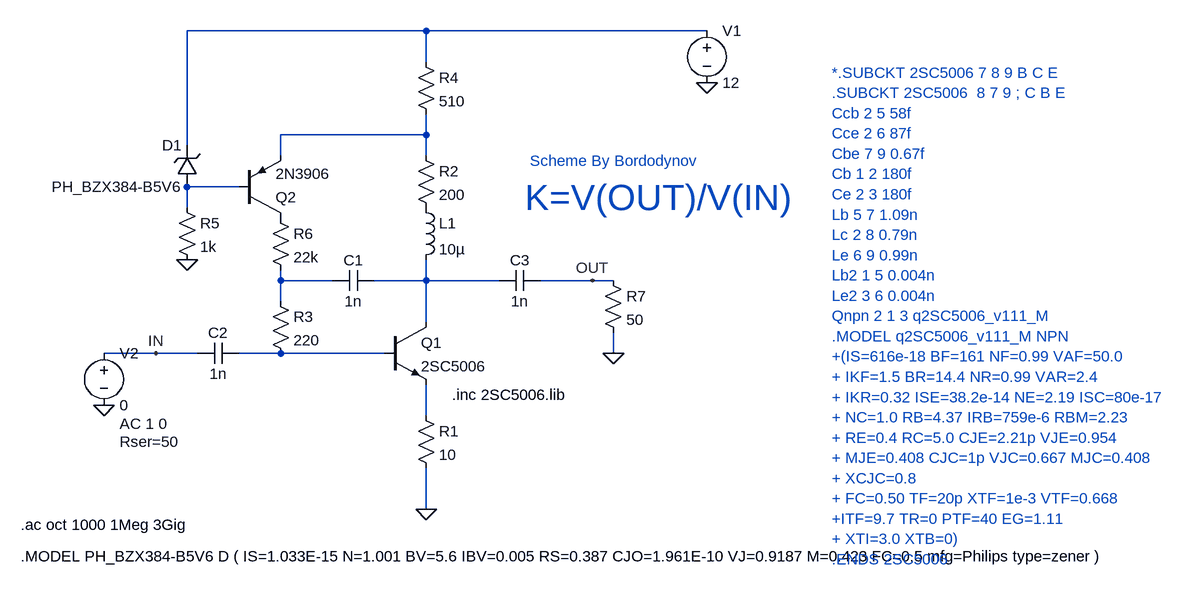
[diagram p0: schematic AMP.asc]
AMP.asc, the LTspice schematic file:
Version 4
SHEET 1 2192 680
WIRE 688 -176 320 -176
WIRE 1120 -176 688 -176
WIRE 688 -128 688 -176
WIRE 688 -16 688 -48
WIRE 688 -16 464 -16
WIRE 320 0 320 -176
WIRE 464 16 464 -16
WIRE 688 16 688 -16
WIRE 400 64 320 64
WIRE 320 96 320 64
WIRE 464 208 464 192
WIRE 544 208 464 208
WIRE 688 208 688 176
WIRE 688 208 608 208
WIRE 800 208 688 208
WIRE 944 208 864 208
WIRE 976 208 944 208
WIRE 464 240 464 208
WIRE 688 272 688 208
WIRE 272 320 192 320
WIRE 336 320 272 320
WIRE 464 320 400 320
WIRE 624 320 464 320
WIRE 976 320 976 288
WIRE 688 416 688 368
WIRE 688 560 688 496
FLAG 1120 -96 0
FLAG 688 560 0
FLAG 192 400 0
FLAG 976 320 0
FLAG 320 176 0
FLAG 944 208 OUT
FLAG 272 320 IN
SYMBOL npn 624 272 R0
SYMATTR InstName Q1
SYMATTR Value 2SC5006
SYMATTR Prefix XQN
SYMBOL res 672 400 R0
SYMATTR InstName R1
SYMATTR Value 10
SYMBOL cap 608 192 R90
WINDOW 0 0 32 VBottom 2
WINDOW 3 32 32 VTop 2
SYMATTR InstName C1
SYMATTR Value 1n
SYMBOL res 672 0 R0
SYMATTR InstName R2
SYMATTR Value 200
SYMBOL res 448 224 R0
SYMATTR InstName R3
SYMATTR Value 220
SYMBOL pnp 400 112 M180
SYMATTR InstName Q2
SYMATTR Value 2N3906
SYMBOL zener 336 64 R180
WINDOW 0 24 64 Left 2
WINDOW 3 24 0 Left 2
SYMATTR InstName D1
SYMATTR Value PH_BZX384-B5V6
SYMATTR Description Diode
SYMATTR Type diode
SYMBOL res 672 -144 R0
SYMATTR InstName R4
SYMATTR Value 510
SYMBOL res 304 80 R0
SYMATTR InstName R5
SYMATTR Value 1k
SYMBOL voltage 1120 -192 R0
WINDOW 123 0 0 Left 2
WINDOW 39 0 0 Left 2
SYMATTR InstName V1
SYMATTR Value 12
SYMBOL ind 672 80 R0
SYMATTR InstName L1
SYMATTR Value 10µ
SYMBOL res 448 96 R0
SYMATTR InstName R6
SYMATTR Value 22k
SYMBOL voltage 192 304 R0
WINDOW 123 24 124 Left 2
WINDOW 39 24 152 Left 2
SYMATTR Value2 AC 1 0
SYMATTR SpiceLine Rser=50
SYMATTR InstName V2
SYMATTR Value 0
SYMBOL cap 400 304 R90
WINDOW 0 0 32 VBottom 2
WINDOW 3 32 32 VTop 2
SYMATTR InstName C2
SYMATTR Value 1n
SYMBOL cap 864 192 R90
WINDOW 0 0 32 VBottom 2
WINDOW 3 32 32 VTop 2
SYMATTR InstName C3
SYMATTR Value 1n
SYMBOL res 960 192 R0
SYMATTR InstName R7
SYMATTR Value 50
TEXT 728 384 Left 2 !.inc 2SC5006.lib
TEXT 64 584 Left 2 !.ac oct 1000 1Meg 3Gig
TEXT 840 80 Left 5 ;K=V(OUT)/V(IN)
TEXT 64 632 Left 2 !.MODEL PH_BZX384-B5V6 D ( IS=1.033E-15 N=1.001 BV=5.6 IBV=0.005 RS=0.387 CJO=1.961E-10 VJ=0.9187 M=0.423 FC=0.5 mfg=Philips type=zener )
TEXT 1312 -112 Left 2 ;*.SUBCKT 2SC5006 7 8 9 B C E\n.SUBCKT 2SC5006  8 7 9 ; C B E\nCcb 2 5 58f\nCce 2 6 87f\nCbe 7 9 0.67f\nCb 1 2 180f\nCe 2 3 180f\nLb 5 7 1.09n\nLc 2 8 0.79n\nLe 6 9 0.99n\nLb2 1 5 0.004n\nLe2 3 6 0.004n\nQnpn 2 1 3 q2SC5006_v111_M\n.MODEL q2SC5006_v111_M NPN\n+(IS=616e-18 BF=161 NF=0.99 VAF=50.0\n+ IKF=1.5 BR=14.4 NR=0.99 VAR=2.4\n+ IKR=0.32 ISE=38.2e-14 NE=2.19 ISC=80e-17\n+ NC=1.0 RB=4.37 IRB=759e-6 RBM=2.23\n+ RE=0.4 RC=5.0 CJE=2.21p VJE=0.954\n+ MJE=0.408 CJC=1p VJC=0.667 MJC=0.408\n+ XCJC=0.8\n+ FC=0.50 TF=20p XTF=1e-3 VTF=0.668\n+ITF=9.7 TR=0 PTF=40 EG=1.11\n+ XTI=3.0 XTB=0)\n.ENDS 2SC5006
TEXT 848 24 Left 2 ;Scheme By Bordodynov

The netlist it stands for:
* AMP.asc
XQ1 N005 N006 N007 2SC5006  ; pins C B E
R1 N007 0 10
C1 N005 N004 1n
R2 N002 P001 200
R3 N004 N006 220
Q2 P002 N003 N002 0 2N3906
D1 N003 N001 PH_BZX384-B5V6
R4 N001 N002 510
R5 N003 0 1k
V1 N001 0 12
L1 P001 N005 10µ
R6 P002 N004 22k
V2 IN 0 0 AC 1 0 Rser=50
C2 N006 IN 1n
C3 OUT N005 1n
R7 OUT 0 50
.model D D
.lib standard.dio
.model NPN NPN
.model PNP PNP
.lib standard.bjt
.inc 2SC5006.lib
.ac oct 1000 1Meg 3Gig
* K=V(OUT)/V(IN)
.MODEL PH_BZX384-B5V6 D ( IS=1.033E-15 N=1.001 BV=5.6 IBV=0.005 RS=0.387 CJO=1.961E-10 VJ=0.9187 M=0.423 FC=0.5 mfg=Philips type=zener )
* *.SUBCKT 2SC5006 7 8 9 B C E
* .SUBCKT 2SC5006  8 7 9 ; C B E
* Ccb 2 5 58f
* Cce 2 6 87f
* Cbe 7 9 0.67f
* Cb 1 2 180f
* Ce 2 3 180f
* Lb 5 7 1.09n
* Lc 2 8 0.79n
* Le 6 9 0.99n
* Lb2 1 5 0.004n
* Le2 3 6 0.004n
* Qnpn 2 1 3 q2SC5006_v111_M
* .MODEL q2SC5006_v111_M NPN
* +(IS=616e-18 BF=161 NF=0.99 VAF=50.0
* + IKF=1.5 BR=14.4 NR=0.99 VAR=2.4
* + IKR=0.32 ISE=38.2e-14 NE=2.19 ISC=80e-17
* + NC=1.0 RB=4.37 IRB=759e-6 RBM=2.23
* + RE=0.4 RC=5.0 CJE=2.21p VJE=0.954
* + MJE=0.408 CJC=1p VJC=0.667 MJC=0.408
* + XCJC=0.8
* + FC=0.50 TF=20p XTF=1e-3 VTF=0.668
* +ITF=9.7 TR=0 PTF=40 EG=1.11
* + XTI=3.0 XTB=0)
* .ENDS 2SC5006
* Scheme By Bordodynov
.backanno
.end